# Altium schematic sheet DT01_Top.SchDoc: DT01 - USB JTAG Interface
size A4; Organization: Altium Limited.; Address1: Level 3, 12a Rodborough Rd; Address2: Frenchs Forest 2086; Address3: NSW; Address4: AUSTRALIA; DocumentNumber: 1; Revision: 01; SheetNumber: 1; SheetTotal: 12; PageSetup: Record=PageOptions|CenterHorizontal=True|CenterVertical=True|PrintScale=0.50|XCorrection=1.00|YCorrection=1.00|PrintKind=0|BorderSize=5000000|LeftOffset=0|BottomOffset=0|Orientation=2|PaperLength=1000|PaperWidth=1000|Scale=100|PaperSource=7|PrintQuality=600|MediaType=1|DitherType=10|PaperKind=A3 (297 x 420 mm)|PrintScaleMode=1
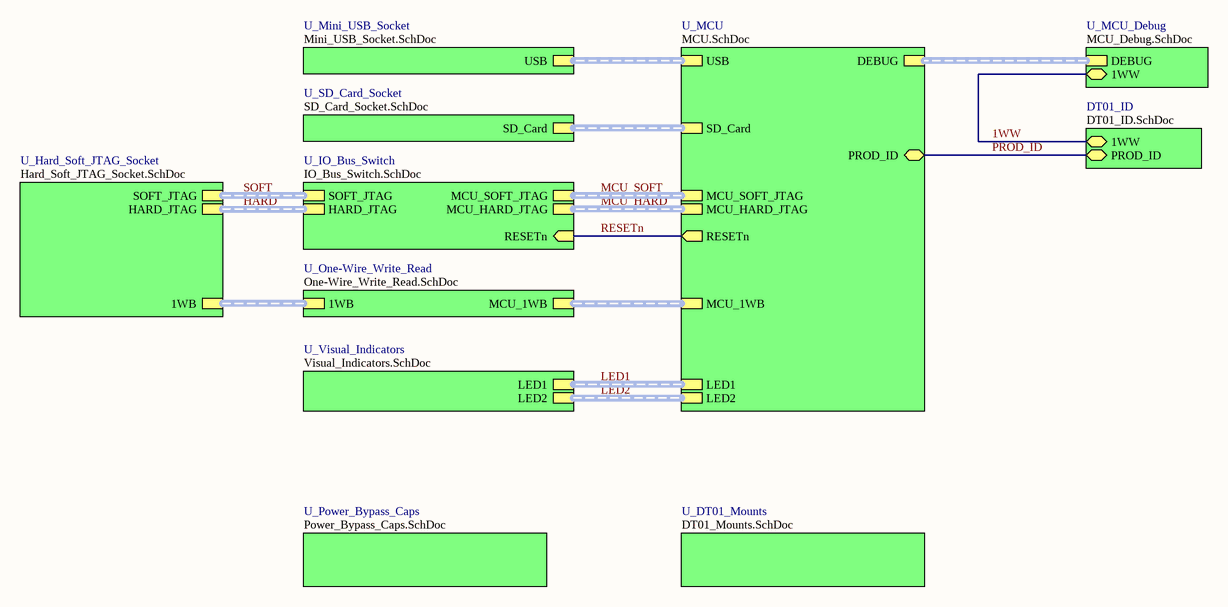
[diagram p0: DT01_Top.SchDoc]

## Sub-sheets
DT01_ID = DT01_ID.SchDoc: PROD_ID (bidir), 1WW (bidir)
U_DT01_Mounts = DT01_Mounts.SchDoc: no entries
U_Hard_Soft_JTAG_Socket = Hard_Soft_JTAG_Socket.SchDoc: 1WB (harness 1WB_Write_Read), SOFT_JTAG (harness JTAG), HARD_JTAG (harness JTAG)
U_IO_Bus_Switch = IO_Bus_Switch.SchDoc: SOFT_JTAG (harness JTAG), HARD_JTAG (harness JTAG), MCU_SOFT_JTAG (harness JTAG), MCU_HARD_JTAG (harness JTAG), RESETn (in)
U_MCU = MCU.SchDoc: USB (harness USB), RESETn (out), DEBUG (harness LOCAL_JTAG), MCU_SOFT_JTAG (harness JTAG), MCU_HARD_JTAG (harness JTAG), MCU_1WB (harness MCU_1WB_R_W), LED1 (harness RGB_LED), LED2 (harness RGB_LED), PROD_ID (bidir), SD_Card (harness SD Card)
U_MCU_Debug = MCU_Debug.SchDoc: DEBUG (harness LOCAL_JTAG), 1WW (bidir)
U_Mini_USB_Socket = Mini_USB_Socket.SchDoc: USB (harness USB)
U_One-Wire_Write_Read = One-Wire_Write_Read.SchDoc: 1WB (harness 1WB_Write_Read), MCU_1WB (harness MCU_1WB_R_W)
U_Power_Bypass_Caps = Power_Bypass_Caps.SchDoc: no entries
U_SD_Card_Socket = SD_Card_Socket.SchDoc: SD_Card (harness SD Card)
U_Visual_Indicators = Visual_Indicators.SchDoc: LED1 (harness RGB_LED), LED2 (harness RGB_LED)

## Nets
1WW: sheet DT01_ID/1WW, sheet U_MCU_Debug/1WW
PROD_ID: sheet U_MCU/PROD_ID, sheet DT01_ID/PROD_ID
RESETn: sheet U_MCU/RESETn, sheet U_IO_Bus_Switch/RESETn

## Buses and harness runs
harness HARD = sheet U_Hard_Soft_JTAG_Socket/HARD_JTAG = sheet U_IO_Bus_Switch/HARD_JTAG
harness LED1 = sheet U_MCU/LED1 = sheet U_Visual_Indicators/LED1
harness LED2 = sheet U_MCU/LED2 = sheet U_Visual_Indicators/LED2
harness MCU_HARD = sheet U_IO_Bus_Switch/MCU_HARD_JTAG = sheet U_MCU/MCU_HARD_JTAG
harness MCU_SOFT = sheet U_IO_Bus_Switch/MCU_SOFT_JTAG = sheet U_MCU/MCU_SOFT_JTAG
harness sheet U_Hard_Soft_JTAG_Socket/1WB = sheet U_One-Wire_Write_Read/1WB
harness sheet U_MCU/DEBUG = sheet U_MCU_Debug/DEBUG
harness sheet U_MCU/MCU_1WB = sheet U_One-Wire_Write_Read/MCU_1WB
harness sheet U_MCU/SD_Card = sheet U_SD_Card_Socket/SD_Card
harness sheet U_MCU/USB = sheet U_Mini_USB_Socket/USB
harness SOFT = sheet U_Hard_Soft_JTAG_Socket/SOFT_JTAG = sheet U_IO_Bus_Switch/SOFT_JTAG

## Notes on the sheet
- Sheet Title
- Project Title
- Size:
- Date:
- A4
- Assy:
- Time:
- Revision:
- Sheet
- of
- File: